# Altium schematic sheet project_ozone_pcb_v1.SchDoc
size A4
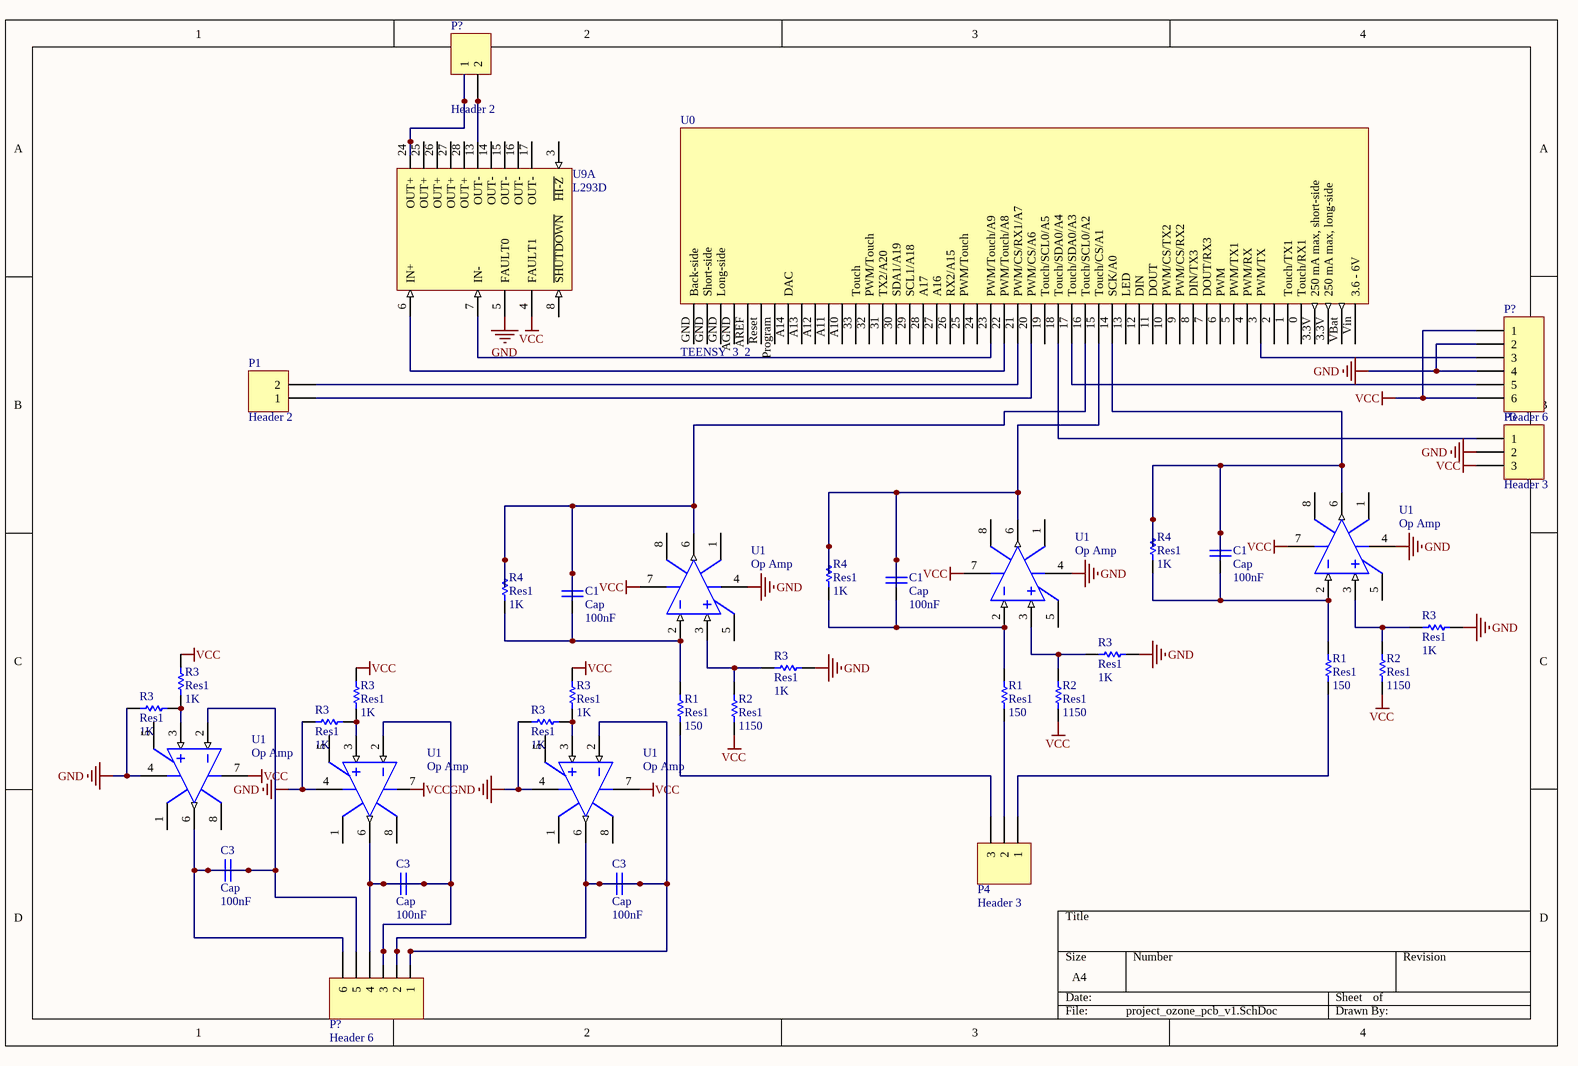
[diagram p0: project_ozone_pcb_v1.SchDoc]

## Parts
(Parts that share a designator on the sheet are numbered #1, #2 ... from top to bottom, then left to right.)
C1#1  Cap  value 100nF  [RAD-0.3]
C1#2  Cap  value 100nF  [RAD-0.3]
C1#3  Cap  value 100nF  [RAD-0.3]
C3#1  Cap  value 100nF  [RAD-0.3]
C3#2  Cap  value 100nF  [RAD-0.3]
C3#3  Cap  value 100nF  [RAD-0.3]
P1  Header 2  [HDR1X2]
P3  Header 3  [HDR1X3]
P4  Header 3  [HDR1X3]
P?#1  Header 2  [HDR1X2]
P?#2  Header 6  [HDR1X6]
P?#3  Header 6  [HDR1X6]
R1#1  Res1  value 150  [AXIAL-0.3]
R1#2  Res1  value 150  [AXIAL-0.3]
R1#3  Res1  value 150  [AXIAL-0.3]
R2#1  Res1  value 1150  [AXIAL-0.3]
R2#2  Res1  value 1150  [AXIAL-0.3]
R2#3  Res1  value 1150  [AXIAL-0.3]
R3#1  Res1  value 1K  [AXIAL-0.3]
R3#2  Res1  value 1K  [AXIAL-0.3]
R3#3  Res1  value 1K  [AXIAL-0.3]
R3#4  Res1  value 1K  [AXIAL-0.3]
R3#5  Res1  value 1K  [AXIAL-0.3]
R3#6  Res1  value 1K  [AXIAL-0.3]
R3#7  Res1  value 1K  [AXIAL-0.3]
R3#8  Res1  value 1K  [AXIAL-0.3]
R3#9  Res1  value 1K  [AXIAL-0.3]
R4#1  Res1  value 1K  [AXIAL-0.3]
R4#2  Res1  value 1K  [AXIAL-0.3]
R4#3  Res1  value 1K  [AXIAL-0.3]
U0  TEENSY_3_2
U1#1  Op Amp  [H-08A]
U1#2  Op Amp  [H-08A]
U1#3  Op Amp  [H-08A]
U1#4  Op Amp  [H-08A]
U1#5  Op Amp  [H-08A]
U1#6  Op Amp  [H-08A]
U9  L293D  [TI-VFP32-3505X3505TP_N]  (part A of 2)

## Nets
GND: P3.2 P?#2.2 P?#2.4 R3#1.1 R3#3.1 R3#6.1 R3#7.1 R3#8.1 R3#9.1 U1#1.4(V-) U1#2.4(V-) U1#3.4(V-) U1#4.4(V-) U1#5.4(V-) U1#6.4(V-) U9.5(FAULT0)
VCC: P3.3 P?#2.1 P?#2.6 R2#1.1 R2#2.1 R2#3.1 R3#2.1 R3#4.1 R3#5.1 U1#1.7(V+) U1#2.7(V+) U1#3.7(V+) U1#4.7(V+) U1#6.7(V+) U9.4(FAULT1)
NetC1#1_1: C1#1.1 R1#1.2 R4#1.1 U1#1.2(IN-)
NetC1#1_2: C1#1.2 R4#1.2 U0.14(SCK/A0) U1#1.6(OUT)
NetC1#2_1: C1#2.1 R1#2.2 R4#2.1 U1#2.2(IN-)
NetC1#2_2: C1#2.2 R4#2.2 U0.15(Touch/CS/A1) U1#2.6(OUT)
NetC1#3_1: C1#3.1 R1#3.2 R4#3.1 U1#3.2(IN-)
NetC1#3_2: C1#3.2 R4#3.2 U0.16(Touch/SCL0/A2) U1#3.6(OUT)
NetC3#1_1: C3#1.1 C3#1.2 P?#3.5 P?#3.6 U1#4.2(IN-) U1#4.6(OUT)
NetC3#2_1: C3#2.1 C3#2.2 P?#3.3 P?#3.4 U1#5.2(IN-) U1#5.6(OUT)
NetC3#3_1: C3#3.1 C3#3.2 P?#3.1 P?#3.2 U1#6.2(IN-) U1#6.6(OUT)
NetP1_1: P1.1 U0.20(PWM/CS/A6)
NetP1_2: P1.2 U0.21(PWM/CS/RX1/A7)
NetP3_1: P3.1 U0.18(Touch/SDA0/A4)
NetP4_1: P4.1 R1#1.1
NetP4_2: P4.2 R1#2.1
NetP4_3: P4.3 R1#3.1
NetP?#1_1: P?#1.1 U9.24(OUT+)
NetP?#1_2: P?#1.2 U9.13(OUT-)
NetP?#2_3: P?#2.3 U0.3(PWM/TX)
NetP?#2_5: P?#2.5 U0.17(Touch/SDA0/A3)
NetR2#1_2: R2#1.2 R3#1.2 U1#1.3(IN+)
NetR2#2_2: R2#2.2 R3#3.2 U1#2.3(IN+)
NetR2#3_2: R2#3.2 R3#6.2 U1#3.3(IN+)
NetR3#2_2: R3#2.2 R3#7.2 U1#4.3(IN+)
NetR3#4_2: R3#4.2 R3#8.2 U1#5.3(IN+)
NetR3#5_2: R3#5.2 R3#9.2 U1#6.3(IN+)
NetU0_22: U0.22(PWM/Touch/A8) U9.6(IN+)
NetU0_23: U0.23(PWM/Touch/A9) U9.7(IN-)

Not connected (* = marked no-connect by the designer): U0 0(Touch/RX1) 1(Touch/TX1) 2 3.3V(250_mA_max,_long-side) 4(PWM/RX) 5(PWM/TX1) 6(PWM) 7(DOUT/RX3) 8(DIN/TX3) 9(PWM/CS/RX2) 10(PWM/CS/TX2) 11(DOUT) 12(DIN) 13(LED) 19(Touch/SCL0/A5) 24 25(PWM/Touch) 26(RX2/A15) 27(A16) 28(A17) 29(SCL1/A18) 30(SDA1/A19) 31(TX2/A20) 32(PWM/Touch) 33(Touch) A10 A11 A12 A13 A14(DAC) AGND AREF GND(Long-side) Program Reset VBat Vin(3.6_-_6V); U1#1 1(OS_NUL) 5(OS_NUL) 8(TAB); U1#2 1(OS_NUL) 5(OS_NUL) 8(TAB); U1#3 1(OS_NUL) 5(OS_NUL) 8(TAB); U1#4 1(OS_NUL) 5(OS_NUL) 8(TAB); U1#5 1(OS_NUL) 5(OS_NUL) 7(V+) 8(TAB); U1#6 1(OS_NUL) 5(OS_NUL) 8(TAB); U9 3(~{HI-Z}) 8(~{SHUTDOWN}) 14(OUT-) 15(OUT-) 16(OUT-) 17(OUT-) 25(OUT+) 26(OUT+) 27(OUT+) 28(OUT+)

## Notes on the sheet
- Labels drawn without touching a wire or pin: VCC

## Library data of the parts
C1#1-C1#3 C3#1-C3#3 = Cap: Capacitor; Published: 8-Jun-2000; LatestRevisionDate: 17-Jul-2002; LatestRevisionNote: Re-released for DXP Platform.; PackageReference: RAD-0.3; Publisher: Altium Limited; PackageDescription: Radial Cap, Thru-Hole; 2 Leads; 0.3 in Pin Spacing
P1 P?#1 = Header 2: Header, 2-Pin; LatestRevisionDate: 17-Jul-2002; LatestRevisionNote: Re-released for DXP Platform.; Publisher: Altium Limited
P3 P4 = Header 3: Header, 3-Pin; LatestRevisionDate: 17-Jul-2002; LatestRevisionNote: Re-released for DXP Platform.; Publisher: Altium Limited
P?#2 P?#3 = Header 6: Header, 6-Pin; LatestRevisionDate: 17-Jul-2002; LatestRevisionNote: Re-released for DXP Platform.; Publisher: Altium Limited
R1#1-R1#3 R2#1-R2#3 R3#1-R3#9 R4#1-R4#3 = Res1: Resistor; Published: 8-Jun-2000; LatestRevisionDate: 17-Jul-2002; LatestRevisionNote: Re-released for DXP Platform.; PackageReference: AXIAL-0.3; Publisher: Altium Limited; PackageDescription: Axial Device, Thru-Hole; 2 Leads; 0.3 in Pin Spacing
U0 = Teensy 3.2
U1#1-U1#6 = Op Amp: FET Operational Amplifier; Published: 8-Jun-2000; LatestRevisionDate: 17-Jul-2002; LatestRevisionNote: Re-released for DXP Platform.; DatasheetVersion: REV. B; PackageVersion: 1990; PackageReference: H-08A; Publisher: Altium Limited; PackageDescription: Can; 8 Leads; Pin Circle Dia. 5.08 mm; Lead Dia. 0.53 mm (max); ComponentLink1Description: Manufacturer Link; ComponentLink1URL: http://www.analog.com/
U9 = DRV592VFP: High-Efficiency H-Bridge (Requires External PWM), -40 to 85 degC, 32-pin QFP (VFP32), Green (RoHS & no Sb/Br); Manufacturer: Texas Instruments; Iq(mA): 0.3; rDS(on)(Ohms): 0.065; Vs(Max)(V): 5.8; Vs(Min)(V): 2.8; DatasheetVersion: SLOS390A; PackageVersion: 4200791/C, 04/2012; PackageReference: VFP32-3505X3505TP; PackageDescription: 32-Pin PowerPAD(TM) Plastic Quad Flatpack, Body 7 x 7 mm, Pitch 0.8 mm; Supplier 1: Digi-Key; Supplier Part Number 1: 296-12550-ND; Supplier 2: Newark; Supplier Part Number 2: 74C9535; Supplier 3: Mouser; Supplier Part Number 3: 595-DRV592VFP; Eco-Plan: Green (RoHS & no Sb/Br); Mounting Technology: Surface Mount; Code_JEDEC: MS-026; PartNumber: DRV592VFP; ComponentLink1Description: Manufacturer URL; ComponentLink1URL: http://www.ti.com/; ComponentLink2Description: Datasheet; ComponentLink2URL: http://www.ti.com/general/docs/lit/getliterature.tsp?genericPartNumber=DRV592&fileType=pdf; ComponentLink3Description: Package Specification; ComponentLink3URL: http://www.ti.com/lit/ml/mpqf098b/mpqf098b.pdf